# Altium schematic sheet 35.SchDoc
size 420 x 297 mm; Scale: 1:1; Обозначение документа: АБВГ.12345.001 Э3; Разраб.: Иванов; Пров.: Петров; Утв.: Сидоров; Наименование организации: ОАО "Концерн "МПО-Гидроприбор"; Перв. применение: АБВГ.123456.000; Наименование изделия 1: Плата; Наименование изделия 2: Схема электрическая; Наименование изделия 3: принципиальная; Нач. отд.: Нач. отд.; Фамилия нач. отд.: Сидоров
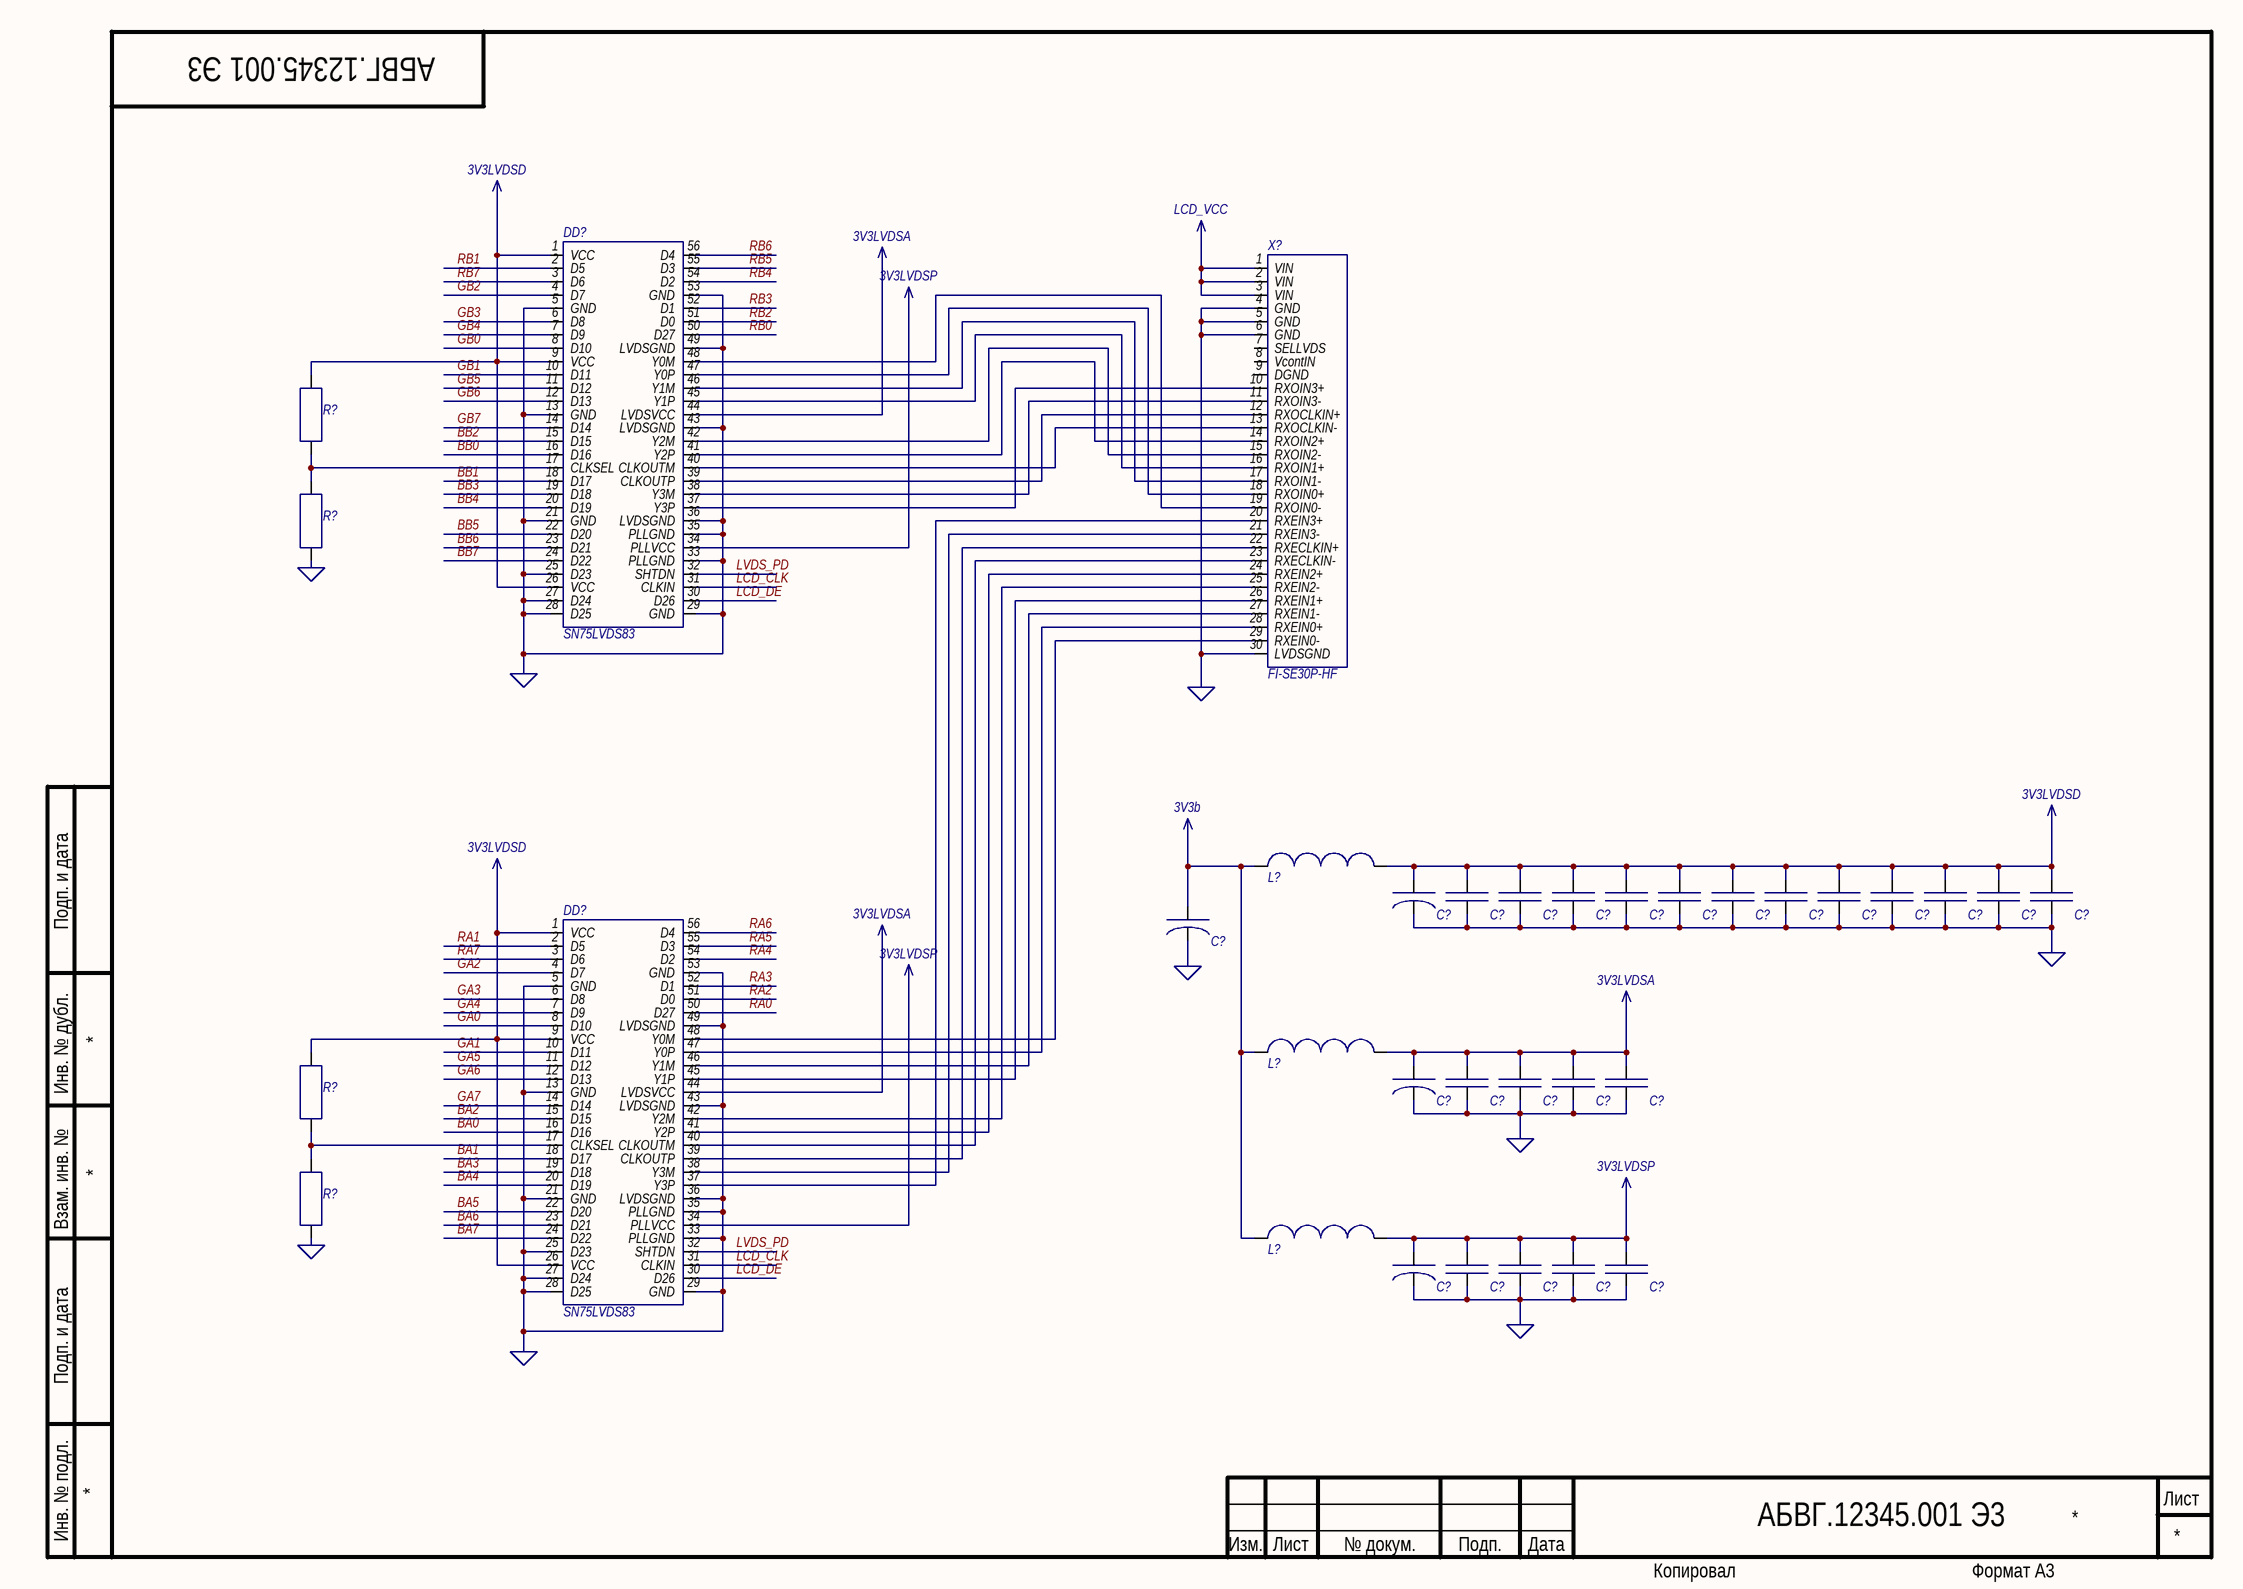
[diagram p0: 35.SchDoc]

## Parts
(Parts that share a designator on the sheet are numbered #1, #2 ... from top to bottom, then left to right.)
C?#1  TuningCapacitor  [Cap_tantal_D]  (value not drawn)
C?#2  TuningCapacitor  [Cap_tantal_D]  (value not drawn)
C?#3  Capacitor  [cap_electro_13]  (value not drawn)
C?#4  Capacitor  [cap_electro_13]  (value not drawn)
C?#5  Capacitor  [cap_electro_13]  (value not drawn)
C?#6  Capacitor  [cap_electro_13]  (value not drawn)
C?#7  Capacitor  [cap_electro_13]  (value not drawn)
C?#8  Capacitor  [cap_electro_13]  (value not drawn)
C?#9  Capacitor  [cap_electro_13]  (value not drawn)
C?#10  Capacitor  [cap_electro_13]  (value not drawn)
C?#11  Capacitor  [cap_electro_13]  (value not drawn)
C?#12  Capacitor  [cap_electro_13]  (value not drawn)
C?#13  Capacitor  [cap_electro_13]  (value not drawn)
C?#14  Capacitor  [cap_electro_13]  (value not drawn)
C?#15  TuningCapacitor  [Cap_tantal_D]  (value not drawn)
C?#16  Capacitor  [cap_electro_13]  (value not drawn)
C?#17  Capacitor  [cap_electro_13]  (value not drawn)
C?#18  Capacitor  [cap_electro_13]  (value not drawn)
C?#19  Capacitor  [cap_electro_13]  (value not drawn)
C?#20  TuningCapacitor  [Cap_tantal_D]  (value not drawn)
C?#21  Capacitor  [cap_electro_13]  (value not drawn)
C?#22  Capacitor  [cap_electro_13]  (value not drawn)
C?#23  Capacitor  [cap_electro_13]  (value not drawn)
C?#24  Capacitor  [cap_electro_13]  (value not drawn)
DD?#1  SN75LVDS83  [SN75LVDS83_v2]
DD?#2  SN75LVDS83  [SN75LVDS83_v2]
L?#1  Inductor  [inductor]  (value not drawn)
L?#2  Inductor  [inductor]  (value not drawn)
L?#3  Inductor  [inductor]  (value not drawn)
R?#1  Resistor  [R_1206]  (value not drawn)
R?#2  Resistor  [R_1206]  (value not drawn)
R?#3  Resistor  [R_1206]  (value not drawn)
R?#4  Resistor  [R_1206]  (value not drawn)
X?  FI-SE30P-HF  [FI-SE30P-HF_v2]

## Nets
3V3b: C?#2.1 L?#1.1 L?#2.1 L?#3.1
3V3LVDSA: C?#15.1 C?#16.2 C?#17.2 C?#18.2 C?#19.2 DD?#1.44(LVDSVCC) DD?#2.44(LVDSVCC) L?#2.2
3V3LVDSD: C?#1.1 C?#3.2 C?#4.2 C?#5.2 C?#6.2 C?#7.2 C?#8.2 C?#9.2 C?#10.2 C?#11.2 C?#12.2 C?#13.2 C?#14.2 DD?#1.1(VCC) DD?#1.9(VCC) DD?#1.26(VCC) DD?#2.1(VCC) DD?#2.9(VCC) DD?#2.26(VCC) L?#1.2 R?#1.2 R?#3.2
3V3LVDSP: C?#20.1 C?#21.2 C?#22.2 C?#23.2 C?#24.2 DD?#1.34(PLLVCC) DD?#2.34(PLLVCC) L?#3.2
GND: C?#1.2 C?#2.2 C?#3.1 C?#4.1 C?#5.1 C?#6.1 C?#7.1 C?#8.1 C?#9.1 C?#10.1 C?#11.1 C?#12.1 C?#13.1 C?#14.1 C?#15.2 C?#16.1 C?#17.1 C?#18.1 C?#19.1 C?#20.2 C?#21.1 C?#22.1 C?#23.1 C?#24.1 DD?#1.5(GND) DD?#1.13(GND) DD?#1.21(GND) DD?#1.25(D23) DD?#1.27(D24) DD?#1.28(D25) DD?#1.29(GND) DD?#1.33(PLLGND) DD?#1.35(PLLGND) DD?#1.36(LVDSGND) DD?#1.43(LVDSGND) DD?#1.49(LVDSGND) DD?#1.53(GND) DD?#2.5(GND) DD?#2.13(GND) DD?#2.21(GND) DD?#2.25(D23) DD?#2.27(D24) DD?#2.28(D25) DD?#2.29(GND) DD?#2.33(PLLGND) DD?#2.35(PLLGND) DD?#2.36(LVDSGND) DD?#2.43(LVDSGND) DD?#2.49(LVDSGND) DD?#2.53(GND) R?#2.1 R?#4.1 X?.4(GND) X?.5(GND) X?.6(GND) X?.30(LVDSGND)
LCD_VCC: X?.1(VIN) X?.2(VIN) X?.3(VIN)
BA0: DD?#2.16(D16)
BA1: DD?#2.18(D17)
BA2: DD?#2.15(D15)
BA3: DD?#2.19(D18)
BA4: DD?#2.20(D19)
BA5: DD?#2.22(D20)
BA6: DD?#2.23(D21)
BA7: DD?#2.24(D22)
BB0: DD?#1.16(D16)
BB1: DD?#1.18(D17)
BB2: DD?#1.15(D15)
BB3: DD?#1.19(D18)
BB4: DD?#1.20(D19)
BB5: DD?#1.22(D20)
BB6: DD?#1.23(D21)
BB7: DD?#1.24(D22)
GA0: DD?#2.8(D10)
GA1: DD?#2.10(D11)
GA2: DD?#2.4(D7)
GA3: DD?#2.6(D8)
GA4: DD?#2.7(D9)
GA5: DD?#2.11(D12)
GA6: DD?#2.12(D13)
GA7: DD?#2.14(D14)
GB0: DD?#1.8(D10)
GB1: DD?#1.10(D11)
GB2: DD?#1.4(D7)
GB3: DD?#1.6(D8)
GB4: DD?#1.7(D9)
GB5: DD?#1.11(D12)
GB6: DD?#1.12(D13)
GB7: DD?#1.14(D14)
LCD_CLK: DD?#1.31(CLKIN) DD?#2.31(CLKIN)
LCD_DE: DD?#1.30(D26) DD?#2.30(D26)
LVDS_PD: DD?#1.32(SHTDN) DD?#2.32(SHTDN)
RA0: DD?#2.50(D27)
RA1: DD?#2.2(D5)
RA2: DD?#2.51(D0)
RA3: DD?#2.52(D1)
RA4: DD?#2.54(D2)
RA5: DD?#2.55(D3)
RA6: DD?#2.56(D4)
RA7: DD?#2.3(D6)
RB0: DD?#1.50(D27)
RB1: DD?#1.2(D5)
RB2: DD?#1.51(D0)
RB3: DD?#1.52(D1)
RB4: DD?#1.54(D2)
RB5: DD?#1.55(D3)
RB6: DD?#1.56(D4)
RB7: DD?#1.3(D6)
NetDD?#1_17: DD?#1.17(CLKSEL) R?#1.1 R?#2.2
NetDD?#1_37: DD?#1.37(Y3P) X?.10(RXOIN3+)
NetDD?#1_38: DD?#1.38(Y3M) X?.11(RXOIN3-)
NetDD?#1_39: DD?#1.39(CLKOUTP) X?.12(RXOCLKIN+)
NetDD?#1_40: DD?#1.40(CLKOUTM) X?.13(RXOCLKIN-)
NetDD?#1_41: DD?#1.41(Y2P) X?.14(RXOIN2+)
NetDD?#1_42: DD?#1.42(Y2M) X?.15(RXOIN2-)
NetDD?#1_45: DD?#1.45(Y1P) X?.16(RXOIN1+)
NetDD?#1_46: DD?#1.46(Y1M) X?.17(RXOIN1-)
NetDD?#1_47: DD?#1.47(Y0P) X?.18(RXOIN0+)
NetDD?#1_48: DD?#1.48(Y0M) X?.19(RXOIN0-)
NetDD?#2_17: DD?#2.17(CLKSEL) R?#3.1 R?#4.2
NetDD?#2_37: DD?#2.37(Y3P) X?.20(RXEIN3+)
NetDD?#2_38: DD?#2.38(Y3M) X?.21(RXEIN3-)
NetDD?#2_39: DD?#2.39(CLKOUTP) X?.22(RXECLKIN+)
NetDD?#2_40: DD?#2.40(CLKOUTM) X?.23(RXECLKIN-)
NetDD?#2_41: DD?#2.41(Y2P) X?.24(RXEIN2+)
NetDD?#2_42: DD?#2.42(Y2M) X?.25(RXEIN2-)
NetDD?#2_45: DD?#2.45(Y1P) X?.26(RXEIN1+)
NetDD?#2_46: DD?#2.46(Y1M) X?.27(RXEIN1-)
NetDD?#2_47: DD?#2.47(Y0P) X?.28(RXEIN0+)
NetDD?#2_48: DD?#2.48(Y0M) X?.29(RXEIN0-)

Not connected (* = marked no-connect by the designer): X? 7(SELLVDS) 8(VcontIN) 9(DGND)

## Notes on the sheet
- Подп. и дата
- Инв. № дубл.
- Взам. инв. №
- Инв. № подл.
- Изм.
- Лист
- № докум.
- Подп.
- Дата
- Копировал
- Формат А3